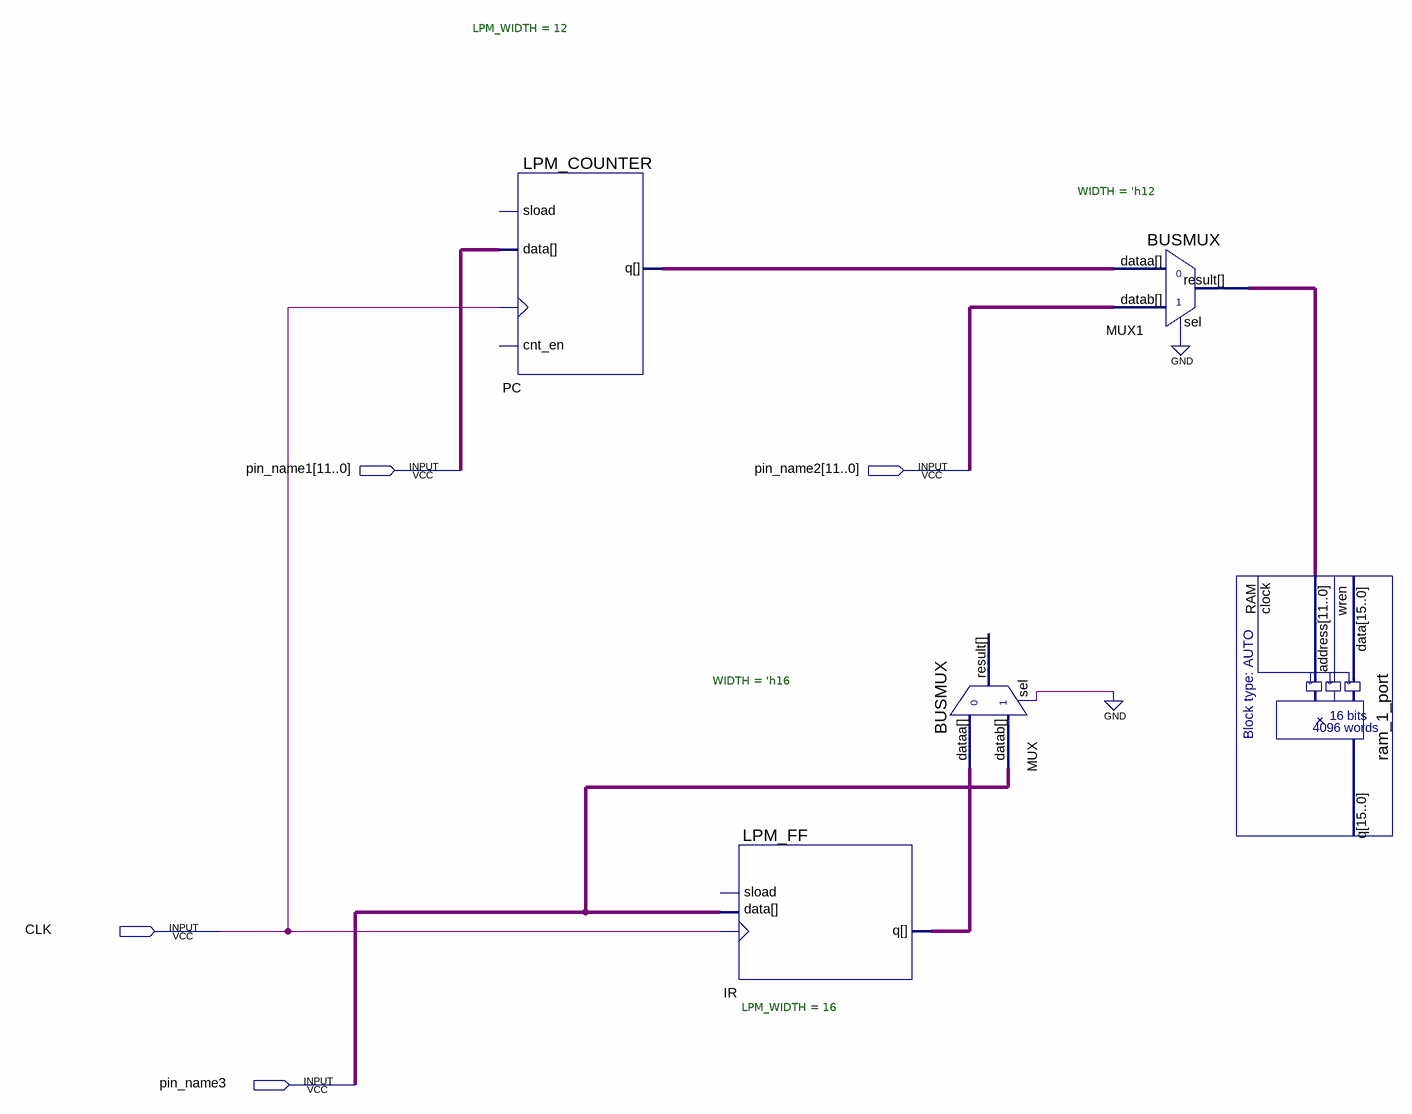
[diagram p0: schematic sheet]
// Quartus schematic MU0CPUFINAL.bdf as structural Verilog: 5 symbols, 4 pins
module MU0CPUFINAL (
  input  [11:0] pin_name1,
  input  [11:0] pin_name2,
  input  CLK,
  input  pin_name3
);

  wire [11:0] MUX1_result, PC_q;
  wire [15:0] IR_q, undriven;

  LPM_COUNTER #(.LPM_WIDTH(12)) PC (.clock(CLK), .data(pin_name1), .q(PC_q));  // open: cnt_en, sload
  LPM_FF #(.LPM_WIDTH(16)) IR (.clock(CLK), .data(undriven), .q(IR_q));  // open: sload
  BUSMUX #(.WIDTH('h16)) MUX (.datab(undriven), .sel(1'b0), .dataa(IR_q));  // open: result
  BUSMUX #(.WIDTH('h12)) MUX1 (.datab(pin_name2), .sel(1'b0), .dataa(PC_q), .result(MUX1_result));
  ram_1_port RAM (.address(MUX1_result));  // open: data, wren, clock, q
endmodule
